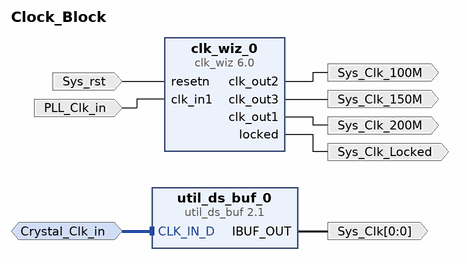
[diagram p0: block diagram of the top level]
# Vivado block design Clock_Block, xc7a100tfgg484-2, Vivado 2018.3
create_bd_design Clock_Block

create_bd_intf_port -mode Slave -vlnv xilinx.com:interface:diff_clock_rtl:1.0 Crystal_Clk_in
create_bd_port -dir I -type rst Sys_rst
create_bd_port -dir O -type clk Sys_Clk_200M
set_property -dict {CONFIG.FREQ_HZ 200000000} [get_bd_ports Sys_Clk_200M]
create_bd_port -dir O -type clk Sys_Clk_100M
create_bd_port -dir O -type clk Sys_Clk_150M
set_property -dict {CONFIG.FREQ_HZ 150000000} [get_bd_ports Sys_Clk_150M]
create_bd_port -dir O Sys_Clk_Locked
create_bd_port -dir O -from 0 -to 0 -type clk Sys_Clk
create_bd_port -dir I -type clk PLL_Clk_in
set_property -dict {CONFIG.FREQ_HZ 200000000} [get_bd_ports PLL_Clk_in]

create_bd_cell -type ip -vlnv xilinx.com:ip:util_ds_buf:2.1 util_ds_buf_0
set_property -dict {CONFIG.C_BUF_TYPE IBUFDSGTE} [get_bd_cells util_ds_buf_0]
create_bd_cell -type ip -vlnv xilinx.com:ip:clk_wiz:6.0 clk_wiz_0
set_property -dict [list \
  CONFIG.CLKIN1_JITTER_PS 50.0 \
  CONFIG.CLKOUT1_JITTER 96.634 \
  CONFIG.CLKOUT1_PHASE_ERROR 91.235 \
  CONFIG.CLKOUT1_REQUESTED_OUT_FREQ 200.000 \
  CONFIG.CLKOUT2_JITTER 110.629 \
  CONFIG.CLKOUT2_PHASE_ERROR 91.235 \
  CONFIG.CLKOUT2_USED true \
  CONFIG.CLKOUT3_JITTER 102.207 \
  CONFIG.CLKOUT3_PHASE_ERROR 91.235 \
  CONFIG.CLKOUT3_REQUESTED_OUT_FREQ 150.000 \
  CONFIG.CLKOUT3_USED true \
  CONFIG.MMCM_CLKFBOUT_MULT_F 4.500 \
  CONFIG.MMCM_CLKIN1_PERIOD 5.000 \
  CONFIG.MMCM_CLKIN2_PERIOD 10.0 \
  CONFIG.MMCM_CLKOUT0_DIVIDE_F 4.500 \
  CONFIG.MMCM_CLKOUT1_DIVIDE 9 \
  CONFIG.MMCM_CLKOUT2_DIVIDE 6 \
  CONFIG.MMCM_DIVCLK_DIVIDE 1 \
  CONFIG.NUM_OUT_CLKS 3 \
  CONFIG.PRIM_IN_FREQ 200.000 \
  CONFIG.RESET_PORT resetn \
  CONFIG.RESET_TYPE ACTIVE_LOW \
] [get_bd_cells clk_wiz_0]

# ---- connections ----

connect_bd_intf_net -intf_net CLK_IN_D_0_1 [get_bd_intf_ports Crystal_Clk_in] [get_bd_intf_pins util_ds_buf_0/CLK_IN_D]
connect_bd_net -net resetn_0_1 [get_bd_ports Sys_rst] [get_bd_pins clk_wiz_0/resetn]
connect_bd_net [get_bd_pins clk_wiz_0/clk_out1] [get_bd_ports Sys_Clk_200M]
connect_bd_net [get_bd_pins clk_wiz_0/clk_out2] [get_bd_ports Sys_Clk_100M]
connect_bd_net [get_bd_pins clk_wiz_0/clk_out3] [get_bd_ports Sys_Clk_150M]
connect_bd_net [get_bd_pins clk_wiz_0/locked] [get_bd_ports Sys_Clk_Locked]
connect_bd_net [get_bd_pins util_ds_buf_0/IBUF_OUT] [get_bd_ports Sys_Clk]
connect_bd_net -net clk_in1_0_1 [get_bd_ports PLL_Clk_in] [get_bd_pins clk_wiz_0/clk_in1]

validate_bd_design
save_bd_design
